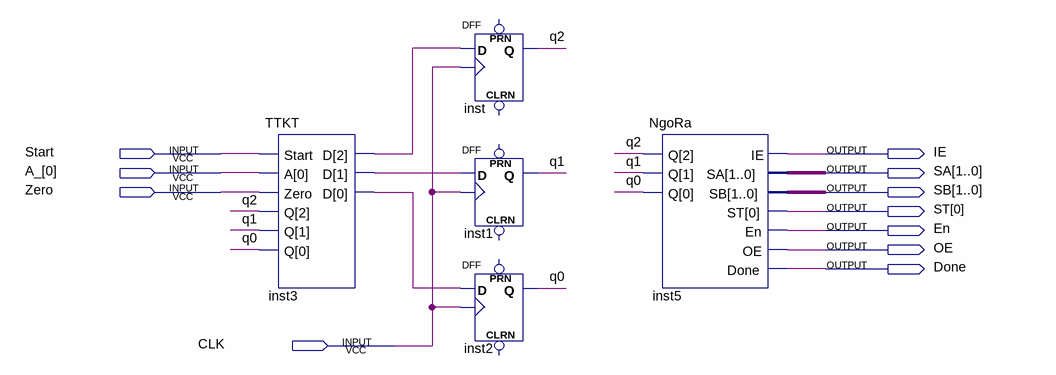
[diagram p0: schematic sheet]
// Quartus schematic Controller.bdf as structural Verilog: 5 symbols, 11 pins
module Controller (
  input  Start,
  input  [0:0] A_,
  input  Zero,
  input  CLK,
  output IE,
  output [1:0] SA,
  output [1:0] SB,
  output [0:0] ST,
  output En,
  output OE,
  output Done
);

  wire inst3_d, inst3_d_2, inst3_d_3, q0, q1, q2;

  TTKT inst3 (.Start(Start), .A(A_[0]), .Zero(Zero), .Q({q2, q1, q0}), .D({inst3_d_2, inst3_d, inst3_d_3}));
  DFF inst (.CLK(CLK), .D(inst3_d_2), .Q(q2));  // open: CLRN, PRN
  DFF inst1 (.CLK(CLK), .D(inst3_d), .Q(q1));  // open: CLRN, PRN
  DFF inst2 (.CLK(CLK), .D(inst3_d_3), .Q(q0));  // open: CLRN, PRN
  NgoRa inst5 (.Q({q2, q1, q0}), .IE(IE), .SA(SA), .SB(SB), .ST(ST[0]), .En(En), .OE(OE), .Done(Done));
endmodule
